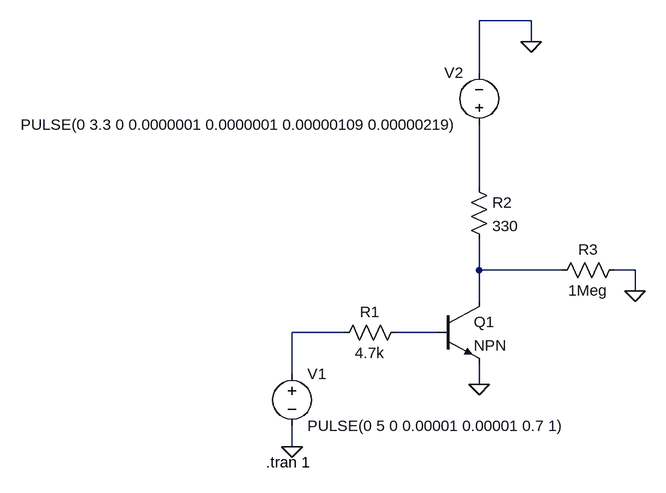
[diagram p0: schematic key.asc]
key.asc, the LTspice schematic file:
Version 4
SHEET 1 1092 680
WIRE 416 -368 336 -368
WIRE 416 -336 416 -368
WIRE 336 -288 336 -368
WIRE 336 -112 336 -208
WIRE 336 16 336 -32
WIRE 464 16 336 16
WIRE 576 16 544 16
WIRE 576 48 576 16
WIRE 336 64 336 16
WIRE 128 112 48 112
WIRE 272 112 208 112
WIRE 48 176 48 112
WIRE 336 192 336 160
WIRE 48 288 48 256
FLAG 48 288 0
FLAG 336 192 0
FLAG 576 48 0
FLAG 416 -336 0
SYMBOL voltage 48 160 R0
WINDOW 123 0 0 Left 0
WINDOW 39 0 0 Left 0
SYMATTR InstName V1
SYMATTR Value PULSE(0 5 0 0.00001 0.00001 0.7 1)
SYMBOL res 224 96 R90
WINDOW 0 0 56 VBottom 2
WINDOW 3 32 56 VTop 2
SYMATTR InstName R1
SYMATTR Value 4.7k
SYMBOL npn 272 64 R0
SYMATTR InstName Q1
SYMBOL res 320 -128 R0
SYMATTR InstName R2
SYMATTR Value 330
SYMBOL res 560 0 R90
WINDOW 0 0 56 VBottom 2
WINDOW 3 32 56 VTop 2
SYMATTR InstName R3
SYMATTR Value 1Meg
SYMBOL voltage 336 -192 R180
WINDOW 0 24 96 Left 2
WINDOW 3 24 16 Left 2
WINDOW 123 0 0 Left 0
WINDOW 39 0 0 Left 0
SYMATTR InstName V2
SYMATTR Value PULSE(0 3.3 0 0.0000001 0.0000001 0.00000109 0.00000219)
TEXT 8 312 Left 2 !.tran 1

The netlist it stands for:
* key.asc
V1 N003 0 PULSE(0 5 0 0.00001 0.00001 0.7 1)
R1 N004 N003 4.7k
Q1 N002 N004 0 0 NPN
R2 N001 N002 330
R3 0 N002 1Meg
V2 N001 0 PULSE(0 3.3 0 0.0000001 0.0000001 0.00000109 0.00000219)
.model NPN NPN
.model PNP PNP
.lib standard.bjt
.tran 1
.backanno
.end